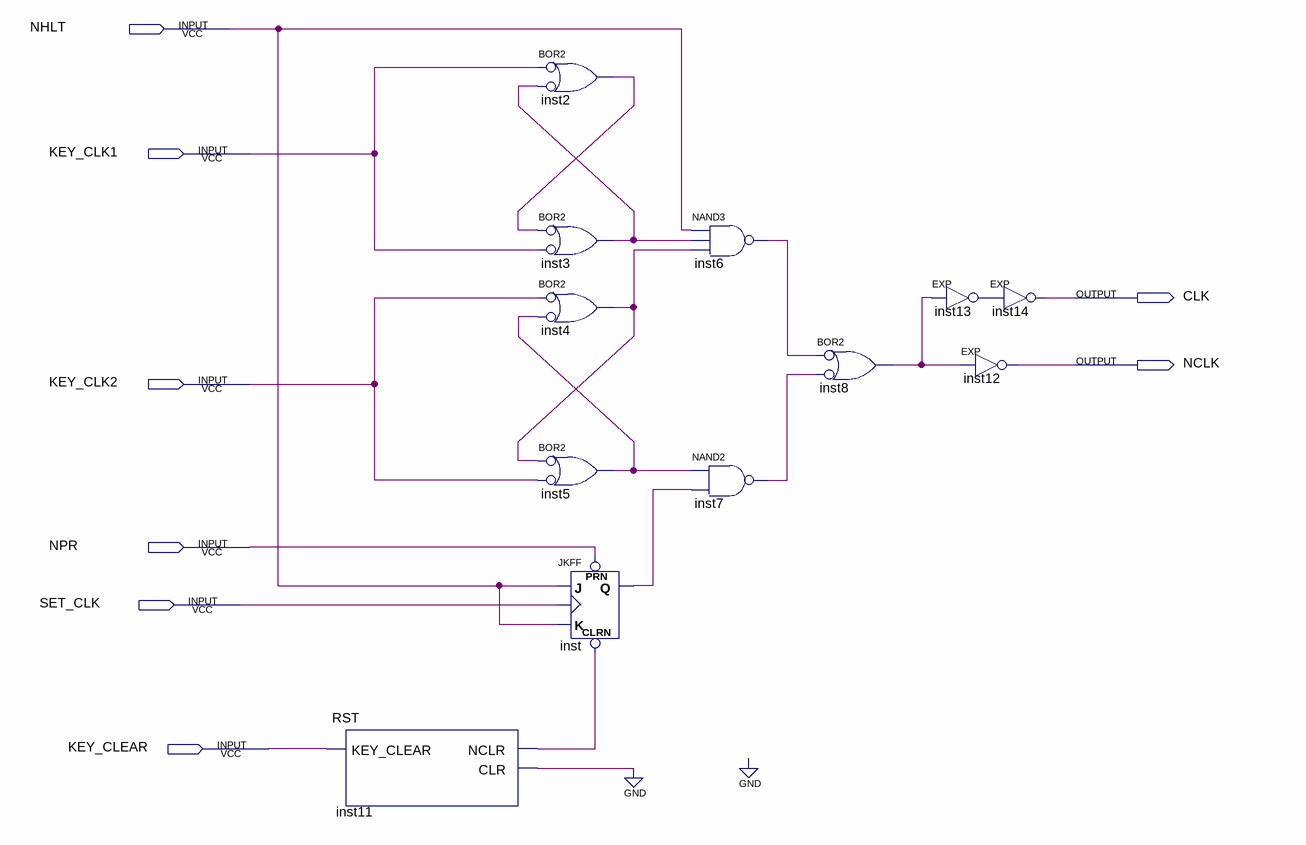
[diagram p0: schematic sheet]
// Quartus schematic CLK.bdf as structural Verilog: 12 symbols, 8 pins
module CLK (
  input  NHLT,
  input  KEY_CLK1,
  input  KEY_CLK2,
  input  NPR,
  input  SET_CLK,
  input  KEY_CLEAR,
  output CLK,
  output NCLK
);

  wire inst2_out, inst3_out, inst4_out, inst5_out, inst6_out, inst7_out, inst8_out, inst11_clr, inst11_nclr,
       inst13_out, inst_q;

  RST inst11 (.KEY_CLEAR(KEY_CLEAR), .NCLR(inst11_nclr), .CLR(inst11_clr));
  or inst2 (inst2_out, ~KEY_CLK1, ~inst3_out);  // BOR2
  or inst3 (inst3_out, ~inst2_out, ~KEY_CLK1);  // BOR2
  or inst4 (inst4_out, ~KEY_CLK2, ~inst5_out);  // BOR2
  or inst5 (inst5_out, ~inst4_out, ~KEY_CLK2);  // BOR2
  JKFF inst (.PRN(NPR), .CLRN(inst11_nclr), .K(NHLT), .J(NHLT), .CLK(SET_CLK), .Q(inst_q));
  nand inst6 (inst6_out, NHLT, inst3_out, inst4_out);
  nand inst7 (inst7_out, inst5_out, inst_q);
  or inst8 (inst8_out, ~inst6_out, ~inst7_out);  // BOR2
  EXP inst13 (.IN(inst8_out), .OUT(inst13_out));
  EXP inst12 (.IN(inst8_out), .OUT(NCLK));
  EXP inst14 (.IN(inst13_out), .OUT(CLK));
  // also tied to GND on the sheet: inst11_clr
endmodule
